# EAGLE design v0.2.0 (EAGLE 9.2.0)
Assembly variants: meanwell, aimtec

## Sheet 1 of 2
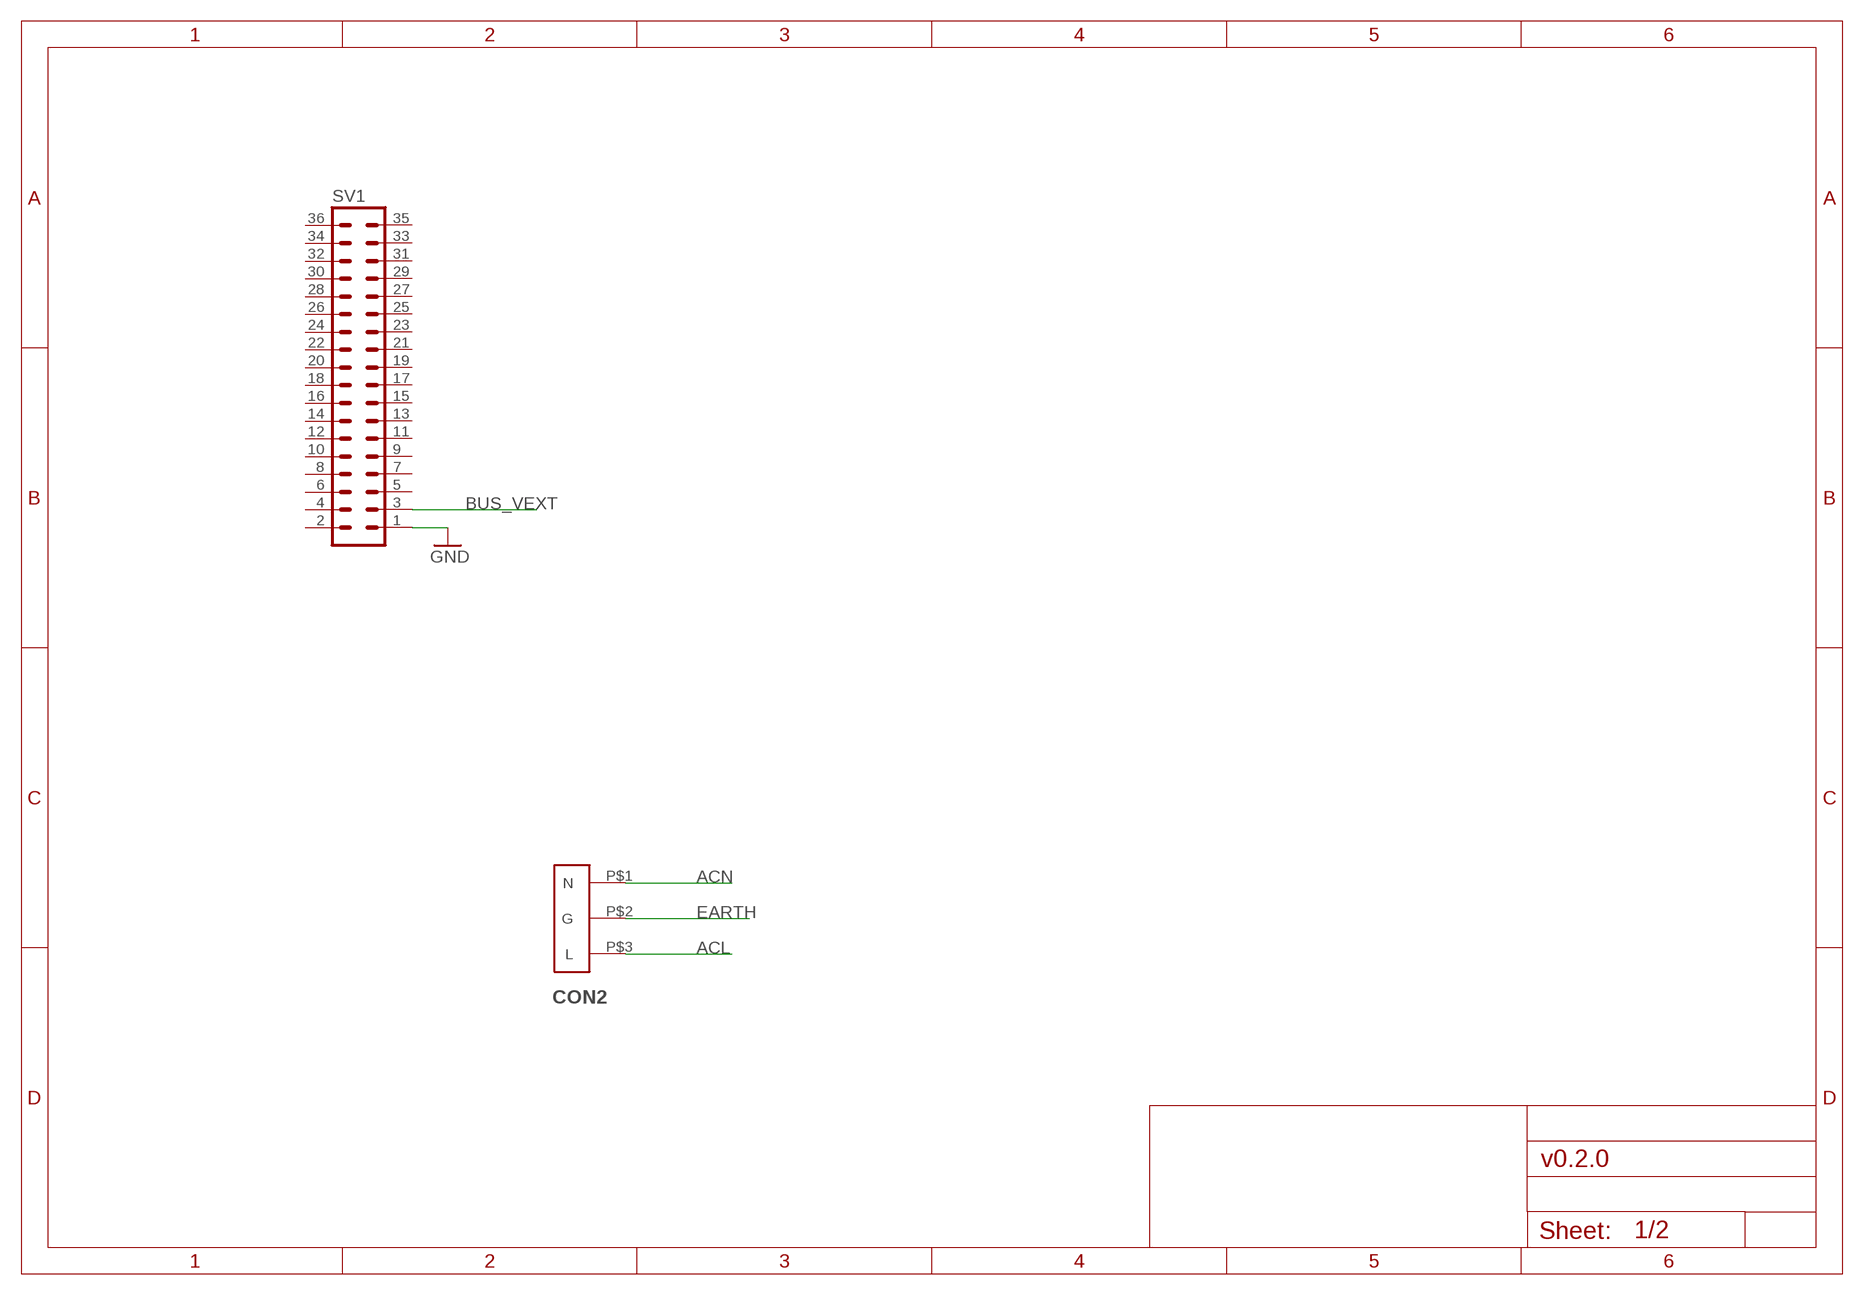
[diagram p0: schematic, sheet 1]

### Parts
CON2  4300.0101  [IEC-C6]
SV1  MA18-2  [MA18-2]

### Nets
ACL: CON2.P$3(L) ; also sheet 2
ACN: CON2.P$1(N) ; also sheet 2
BUS_VEXT: SV1.3 ; also sheet 2
EARTH: CON2.P$2(G) ; also sheet 2
GND: SV1.1 ; also sheet 2
Unconnected: SV1.2 SV1.4 SV1.5 SV1.6 SV1.7 SV1.8 SV1.9 SV1.10 SV1.11 SV1.12 SV1.13 SV1.14 SV1.15 SV1.16 SV1.17 SV1.18 SV1.19 SV1.20 SV1.21 SV1.22 SV1.23 SV1.24 SV1.25 SV1.26 SV1.27 SV1.28 SV1.29 SV1.30 SV1.31 SV1.32 SV1.33 SV1.34 SV1.35 SV1.36

## Sheet 2 of 2
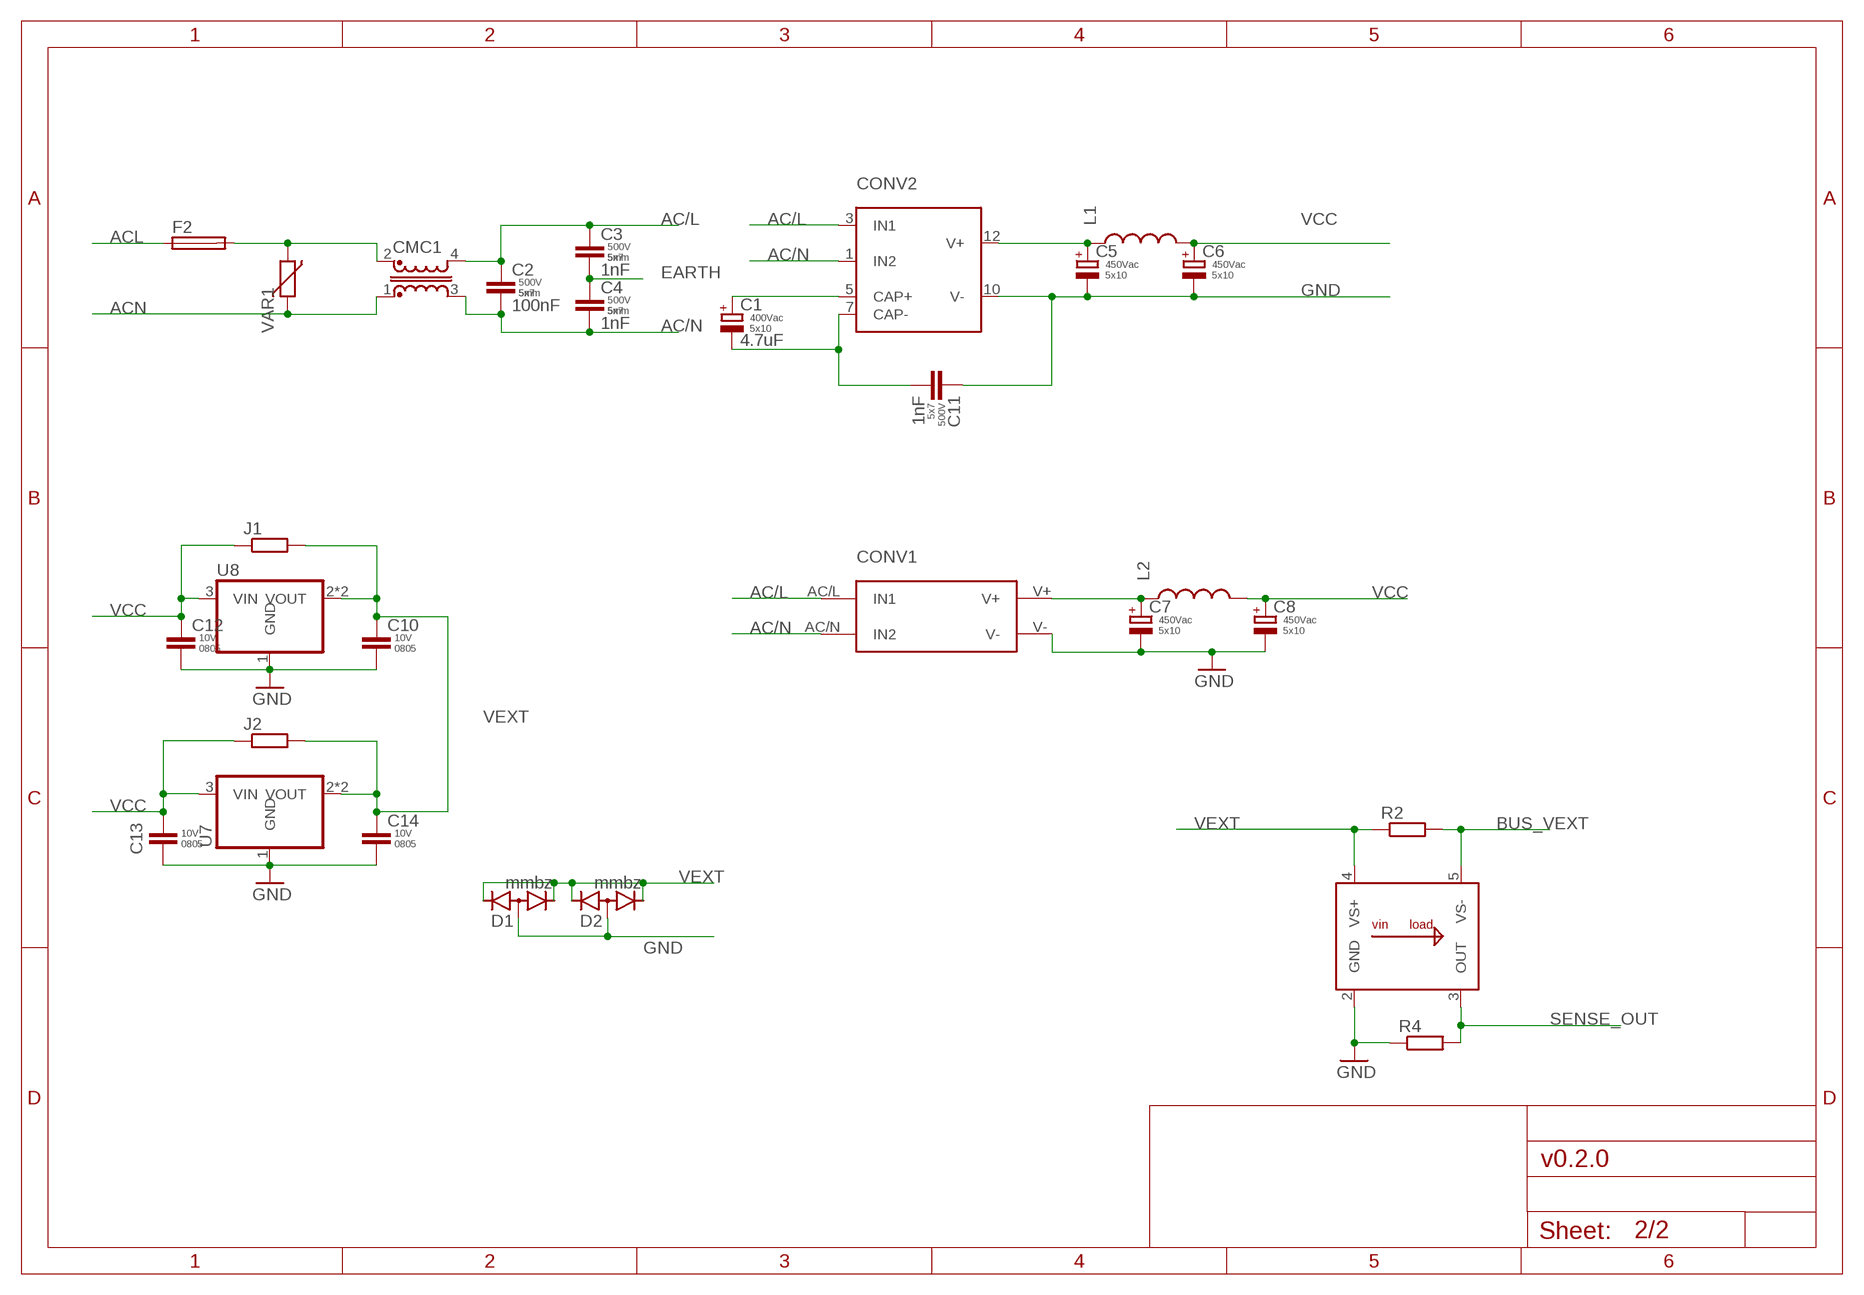
[diagram p1: schematic, sheet 2]

### Parts
C1  4.7uF  CAP-POL-5PX10WX16H  [CAPPRD508W65D1000H1600B]  (not fitted in variant meanwell)
C2  100nF  CAP-P5W6H8T2.5  [C050-025X075]
C3  1nF  CAP-P5W6H8T2.5  [C050-025X075]
C4  1nF  CAP-P5W6H8T2.5  [C050-025X075]
C5  CAP-POL-5PX10WX16H  [CAPPRD508W65D1000H1600B]  (not fitted in variant meanwell)
C6  CAP-POL-5PX10WX16H  [CAPPRD508W65D1000H1600B]  (not fitted in variant meanwell)
C7  CAP-POL-5PX10WX16H  [CAPPRD508W65D1000H1600B]
C8  CAP-POL-5PX10WX16H  [CAPPRD508W65D1000H1600B]
C10  CAP-0805  [C0805]  (not fitted in variant meanwell)
C11  1nF  CAP-P5W6H8T2.5  [C050-025X075]  (not fitted in variant meanwell)
C12  CAP-0805  [C0805]  (not fitted in variant meanwell)
C13  CAP-0805  [C0805]
C14  CAP-0805  [C0805]
CMC1  DLD-302U-1A  [DLD]
CONV1  IRM-03-12V  [IRM-03]
CONV2  AMEOF312SJZ  [AMEOF3-JZ]
D1  mmbz  DIODE-2CA|ACSOT23  [SOT23]
D2  mmbz  DIODE-2CA|ACSOT23  [SOT23]  (not fitted in variant meanwell)
F2  ZH8  [ZH8X2]
IC1  ZXCT1021  [SOT95P240X110-5]
J1  R-EU_R0805  [R0805]
J2  R-EU_R0805  [R0805]
L1  COIL0608-0.022  [COIL0608]  (not fitted in variant meanwell)
L2  COIL0608-0.022  [COIL0608]
R2  R-EU_R0805  [R0805]
R4  R-EU_R0603  [R0603]
U7  LD1117S50  [SOT230P700X180-4]
U8  LD1117S50  [SOT230P700X180-4]  (not fitted in variant meanwell)
VAR1  S14K250  [C7.5B4]

### Nets
AC/L: C2.1 C3.1 CMC1.4 CONV1.AC/L(IN1) CONV2.3(IN1)
AC/N: C2.2 C4.2 CMC1.3 CONV1.AC/N(IN2) CONV2.1(IN2)
ACL: F2.1 F2.1A ; also sheet 1
ACN: CMC1.1 VAR1.1 ; also sheet 1
BUS_VEXT: IC1.5(VS-) R2.2 ; also sheet 1
EARTH: C3.2 C4.1 ; also sheet 1
GND: C5.2(-) C6.2(-) C7.2(-) C8.2(-) C10.2 C11.1 C12.2 C13.2 C14.2 CONV1.V- CONV2.10(V-) D1.3(A) D2.3(A) IC1.2(GND) R4.1 U7.1(GND) U8.1(GND) ; also sheet 1
N$1: C1.1(+) CONV2.5(CAP+)
N$2: C1.2(-) C11.2 CONV2.7(CAP-)
N$3: C5.1(+) CONV2.12(V+) L1.P$1
N$4: CMC1.2 F2.2 F2.2A VAR1.2
N$6: C7.1(+) CONV1.V+ L2.P$1
SENSE_OUT: IC1.3(OUT) R4.2
VCC: C6.1(+) C8.1(+) C12.1 C13.1 J1.1 J2.1 L1.P$2 L2.P$2 U7.3(VIN) U8.3(VIN)
VEXT: C10.1 C14.1 D1.1(K1) D1.2(K2) D2.1(K1) D2.2(K2) IC1.4(VS+) J1.2 J2.2 R2.1 U7.2(VOUT) U7.4(VOUT) U8.2(VOUT) U8.4(VOUT)

## Library data of the parts
C1 = parts-passives:CAP-POL-; PACKAGE: 5x10; RATING: 400Vac
C2-C4 = parts-passives:CAP-; DIMENSIONS: 5mm; PACKAGE: 5x7; RATING: 500V
C5-C8 = parts-passives:CAP-POL-; PACKAGE: 5x10; RATING: 450Vac
C10 C12-C14 = parts-passives:CAP-; PACKAGE: 0805; RATING: 10V
C11 = parts-passives:CAP-; PACKAGE: 5x7; RATING: 500V
CMC1 = parts-ferrocore:DLD-
CON2 = parts-schurter:4300.0101
CONV1 = parts-meanwell:IRM-
CONV2 = parts-aimtec:AMEOF3
D1 D2 = diode:DIODE-2CA|AC: Dual DIODE Cathode-Anode|Anode-Cathode
F2 = parts-profuse:ZH8: there are two zh8 holders used
IC1 = parts-diodes:ZXCT1021
J1 J2 R2 R4 = rcl:R-EU_: RESISTOR, European symbol; SPICEPREFIX: R
L1 L2 = parts-ferrocore:COIL0608-
SV1 = con-lstb:MA18-2: PIN HEADER; OC_FARNELL: unknown; OC_NEWARK: unknown
U7 U8 = parts-st:LD1117
VAR1 = parts-epcos:S14K250

## Board
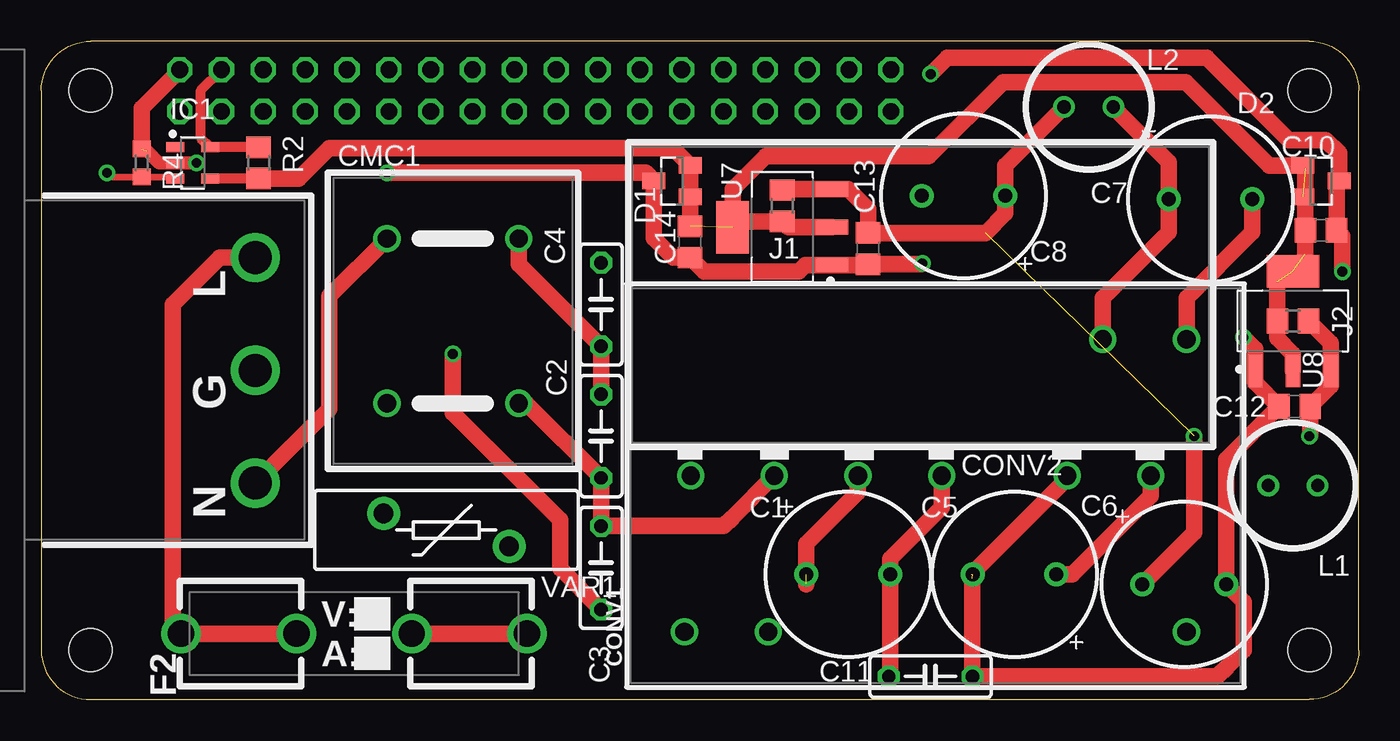
[diagram p2: board, top side]
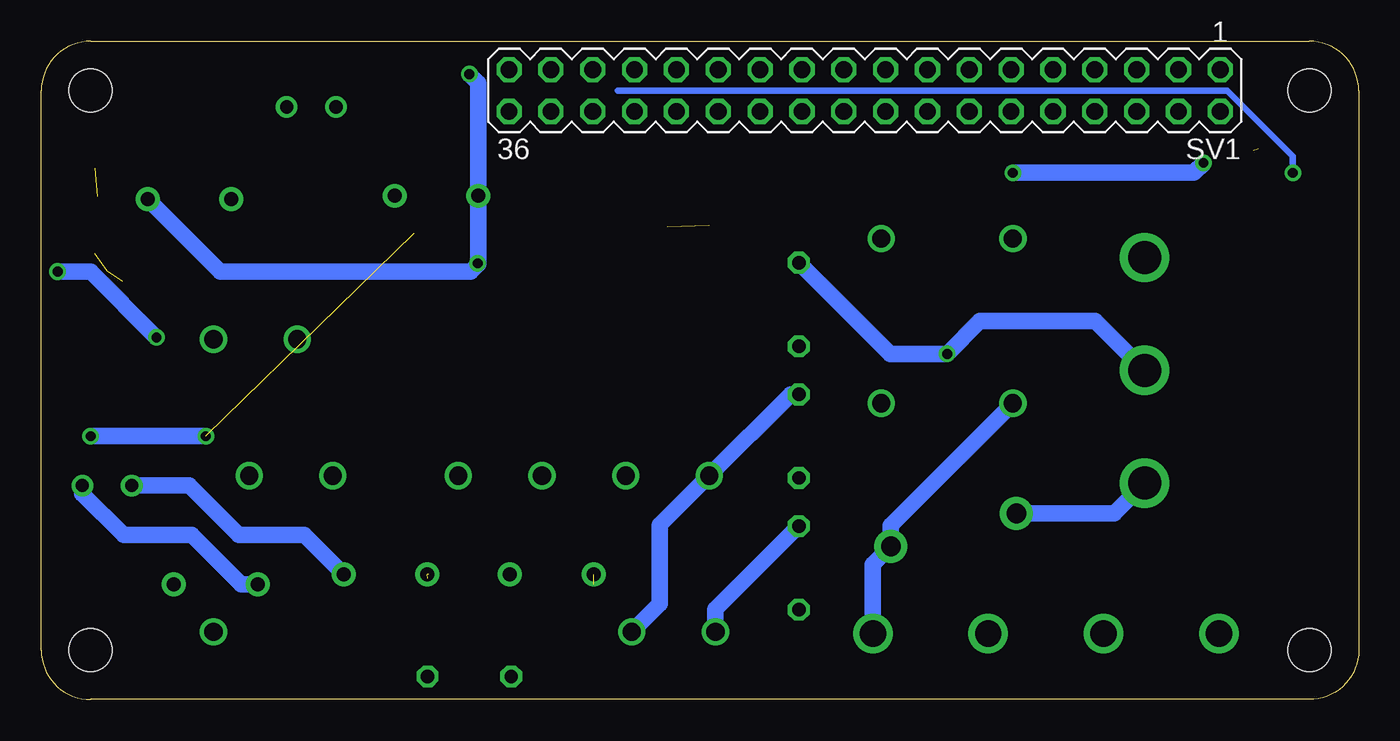
[diagram p3: board, bottom side, seen from below]

Size 80 x 40 mm. Coordinates in mm from the lower left corner, seen from the top.
Outline: 3,0 77,0 arc90 80,3 80,37 arc90 77,40 3,40 arc90 0,37 0,3 arc90 3,0
Copper layers (1*16): Top 0.035mm / dielectric 1.5mm / Bottom 0.035mm
Design rules "default *": minimum track width 6mil, minimum drill 0.35mm, track to track 6mil, track to pad 6mil, pad to pad 6mil, via to via 6mil, smd to smd 6mil, copper to edge 0.4mm, drill to drill 6mil, minimum pad ring 10mil, minimum via ring 8mil, stop-mask expansion 4mil, vias tented up to drill 0mil, thermal gap 10mil
Holes 2.6 mm at 3,3 3,37 77,37 77,3
bKeepout: area 0.5,0.5 to 5.5,5.5; area 0.5,34.5 to 5.5,39.5; area 74.5,34.5 to 79.5,39.5; area 74.5,0.5 to 79.5,5.5
tRestrict: area 0.5,0.5 to 5.5,5.5; area 0.5,34.5 to 5.5,39.5; area 74.5,34.5 to 79.5,39.5; area 74.5,0.5 to 79.5,5.5

### Footprints (pad centres in the part's own frame; a part is rotated, then mirrored left to right if it is on the bottom)
CAPPRD508W65D1000H1600B = drill 0.85 pad 1.45: 1 -2.54,0; 2 2.54,0
C050-025X075 = drill 0.813 octagon: 1 -2.54,0; 2 2.54,0
C0805 = smd 1.3 x 1.5: 1 -0.95,0; 2 0.95,0
DLD = drill 1.1: 1 -5,-4; 2 5,-4; 3 -5,4; 4 5,4
IEC-C6 = drill 2: P$1 -6.85,0; P$2 0,0; P$3 6.85,0
IRM-03 = drill 1.1: AC/L -15.24,-8.89; AC/N -10.16,-8.89; NC 15.24,-8.89; V+ 10.16,8.89; V- 15.24,8.89
AMEOF3-JZ = drill 1.1: 1 -13.97,-11; 3 -8.89,-11; 5 -3.81,-11; 7 1.27,-11; 10 8.89,-11; 12 13.97,-11
SOT23 = smd 1 x 1.4: 1 -0.95,-1.1; 2 0.95,-1.1; 3 0,1.1
ZH8X2 = drill 1.6: 1 -10.5,0; 1A -3.5,0; 2 3.5,0; 2A 10.5,0
SOT95P240X110-5 = smd 1.103 x 0.609: 1 -1.063,0.95; 2 -1.063,0; 3 -1.063,-0.95; 4 1.063,-0.95; 5 1.063,0.95
R0805 = smd 1.3 x 1.5: 1 -0.95,0; 2 0.95,0
COIL0608 = drill 0.8: P$1 -1.5,0; P$2 1.5,0
R0603 = smd 1 x 1.1: 1 -0.85,0; 2 0.85,0
MA18-2 = drill 1.016 octagon: 1 -21.59,-1.27; 2 -21.59,1.27; 3 -19.05,-1.27; 4 -19.05,1.27; 5 -16.51,-1.27; 6 -16.51,1.27; 7 -13.97,-1.27; 8 -13.97,1.27; 9 -11.43,-1.27; 10 -11.43,1.27; 11 -8.89,-1.27; 12 -8.89,1.27; 13 -6.35,-1.27; 14 -6.35,1.27; 15 -3.81,-1.27; 16 -3.81,1.27; 17 -1.27,-1.27; 18 -1.27,1.27; 19 1.27,-1.27; 20 1.27,1.27; 21 3.81,-1.27; 22 3.81,1.27; 23 6.35,-1.27; 24 6.35,1.27; 25 8.89,-1.27; 26 8.89,1.27; 27 11.43,-1.27; 28 11.43,1.27; 29 13.97,-1.27; 30 13.97,1.27; 31 16.51,-1.27; 32 16.51,1.27; 33 19.05,-1.27; 34 19.05,1.27; 35 21.59,-1.27; 36 21.59,1.27
SOT230P700X180-4 = smd 1.965 x 0.889: 1 -3.023,2.3; 2 -3.023,0; 3 -3.023,-2.3 | smd 1.965 x 3.189: 4 3.023,0
C7.5B4 = drill 1.2 pad 2: 1 -3.81,1; 2 3.81,-1

### Placement (x,y rotation side)
C1  49,7.6 0 top  (not fitted)
C2  34,16 90 top
C3  34,8 270 top
C4  34,24 270 top
C5  59.1,7.6 180 top  (not fitted)
C6  69.4,7 0 top  (not fitted)
C7  71,30.4 0 top
C8  56,30.6 180 top
C10  77.7,28.5 0 top  (not fitted)
C11  54,1.4 180 top  (not fitted)
C12  76.1,17.8 180 top  (not fitted)
C13  50.2,27.4 270 top
C14  39.4,27.8 270 top
CMC1  25,23 270 top
CON2  13,20 90 top
CONV1  54.3,13 0 top
CONV2  53.4,24.6 0 top
D1  38.3,31.5 90 top
D2  77.7,31.5 270 top  (not fitted)
F2  19,4 0 top
IC1  9.2,32.6 0 top
J1  45,30 270 top
J2  76,23 180 top
L1  76,13 0 top  (not fitted)
L2  63.6,36 180 top
R2  13.2,32.6 90 top
R4  6.1,32.6 270 top
SV1  30,37 180 bottom
U7  45,28.7 180 top
U8  76,23 90 top  (not fitted)
VAR1  24.6,10.3 0 top

### Tracks (layer width: path | path; a pad name or v marks a point on that pad's centre or on a via)
AC/L
  Top 1: CMC1.4 29.46,18 C2.1 C3.1 41.45,10.54 41.95,11.04 CONV2.3
  Bottom 1: C3.1 39.06,5.48 CONV1.AC/L
AC/N
  Top 1: CMC1.3 29,26.46 C4.2 C2.2
  Bottom 1: CONV1.AC/N 42.43,5.82 42.43,10.6 CONV2.1 34.49,18.54 C2.2
ACL
  Top 1: CON2.P$3 10.85,26.85 8,24 8,4.5 F2.1 F2.1A
ACN
  Top 1: CON2.P$1 17.5,17.65 17.5,24.5 CMC1.1
  Bottom 1: CON2.P$1 14.85,11.3 VAR1.1
BUS_VEXT
  Top 0.6: R2.2 IC1.5 9.7,34.11 9.7,37.02 SV1.3
EARTH  (via drill 0.6)
  Top 1: C3.2 31.5,7.96 31.5,10.9 25,17.4 v25,21
  Bottom 1: C4.1 28.46,21 v25,21 23,23 16,23 CON2.P$2
GND  (via drill 0.6)  (3 unrouted)
  Top 0.8: 6.4,33.35 7.15,32.6 IC1.2 v9.43,32.6
  Top 1: CONV2.10 62.29,13.43 56.46,7.6 | CONV1.V- 69.54,24.4 73.54,28.4 C7.2 | v79,26 79,28.15 C10.2 78.65,31.35 D2.3 78.8,33.2 78,34 75.76,34 70.76,39 55,39 v54,38 | v53.5,26.5 53.45,26.45 C13.2 50.15,26.4 U7.1 46.4,26.4 46,26 40.25,26 C14.2 38.38,26.85 37.2,28.03 D1.3 36.7,32 v21,32 | SV1.1 8.41,38.23 6.1,35.92 R4.1 | v73,22 73.7,21.3 U8.1 73.7,19.25 C12.2 71.94,14.59 C6.2 73,5.94 73,3 72,2 71.4,1.4 C11.1 56.54,7.36
  Bottom 1: v73,22 77,26 v79,26 | v54,38 53.46,37.46 C8.2 53.46,26.46 | v53.5,26.5 53.46,26.46 | v21,32 10.03,32 v9.43,32.6 | C7.2 69.14,26 53.92,26 53.46,26.46
N$1  (1 unrouted)
  Top 1: CONV2.5 49.59,12.59 46.46,9.46 46.46,7
N$2
  Top 1: CONV2.7 54.67,11.67 51.54,8.54 C1.2 51.54,1.48 C11.2
N$3
  Top 1: CONV2.12 67.37,12.37 62.6,7.6 C5.1
  Bottom 1: C5.1 64.04,10 68,10 71,13 L1.P$1
N$4
  Top 1: F2.2 F2.2A
  Bottom 1: F2.2A 29.5,8.21 VAR1.2 28.41,10.59 CMC1.2
N$6
  Top 1: CONV1.V+ 64.46,24.4 68.46,28.4 C7.1 68.46,32.64 L2.P$1
SENSE_OUT  (via drill 0.6)
  Top 0.4: IC1.3 8.04,31.75 R4.2 4.25,31.75 v4,32
  Bottom 0.4: v4,32 4,33 8,37 45,37
VCC  (via drill 0.6)  (1 unrouted)
  Top 1: C6.1 70,10.14 v70,16 | v77,16 77.05,16.05 C12.1 78.3,19.05 U8.3 78.3,21.65 J2.1 | L2.P$2 58.54,32.44 C8.1 58.54,29.54 57.35,28.35 C13.1 50.2,29.8 49,31 U7.3 45.05,31 J1.1
  Bottom 1: C6.1 67.86,7 70.86,10 75,10 77.5,12.5 L1.P$2 | v70,16 v77,16
VEXT  (4 unrouted)
  Top 0.6: R2.1 IC1.4
  Top 1: 75.05,25.4 J2.2 75.05,21.95 76,21 U8.2 | 76.75,27.1 C10.1 76.75,32.3 D2.1 74.55,32.45 69.5,37.5 58.4,37.5 53.9,33 44,33 42,31 42,28.72 U7.4 42.33,29.05 J1.2 45.35,28.7 U7.2 | 39.45,28.8 C14.1 D1.1 D1.2 38.35,33.5 17.5,33.5 15.65,31.65 R2.1